# Altium schematic sheet 8-to-1_MUX.SchDoc: 8:1 MUX
size A3; Author: M.Beldyga; CompanyName: WUT ISE; DrawnBy: M.Beldyga; Organization: WUT ISE; Address1: PW ISE; Address2: Nowowiejska 15/19 00-665 Warsaw; Address3: micbeldyga@gmail.com; SheetNumber: 4; SheetTotal: 8; ModifiedBy: -; CheckedDate: -; DivGrp: WUT ISE; Designer: M.Beldyga; ModifiedDate: -; ProjectName: Sensor Box
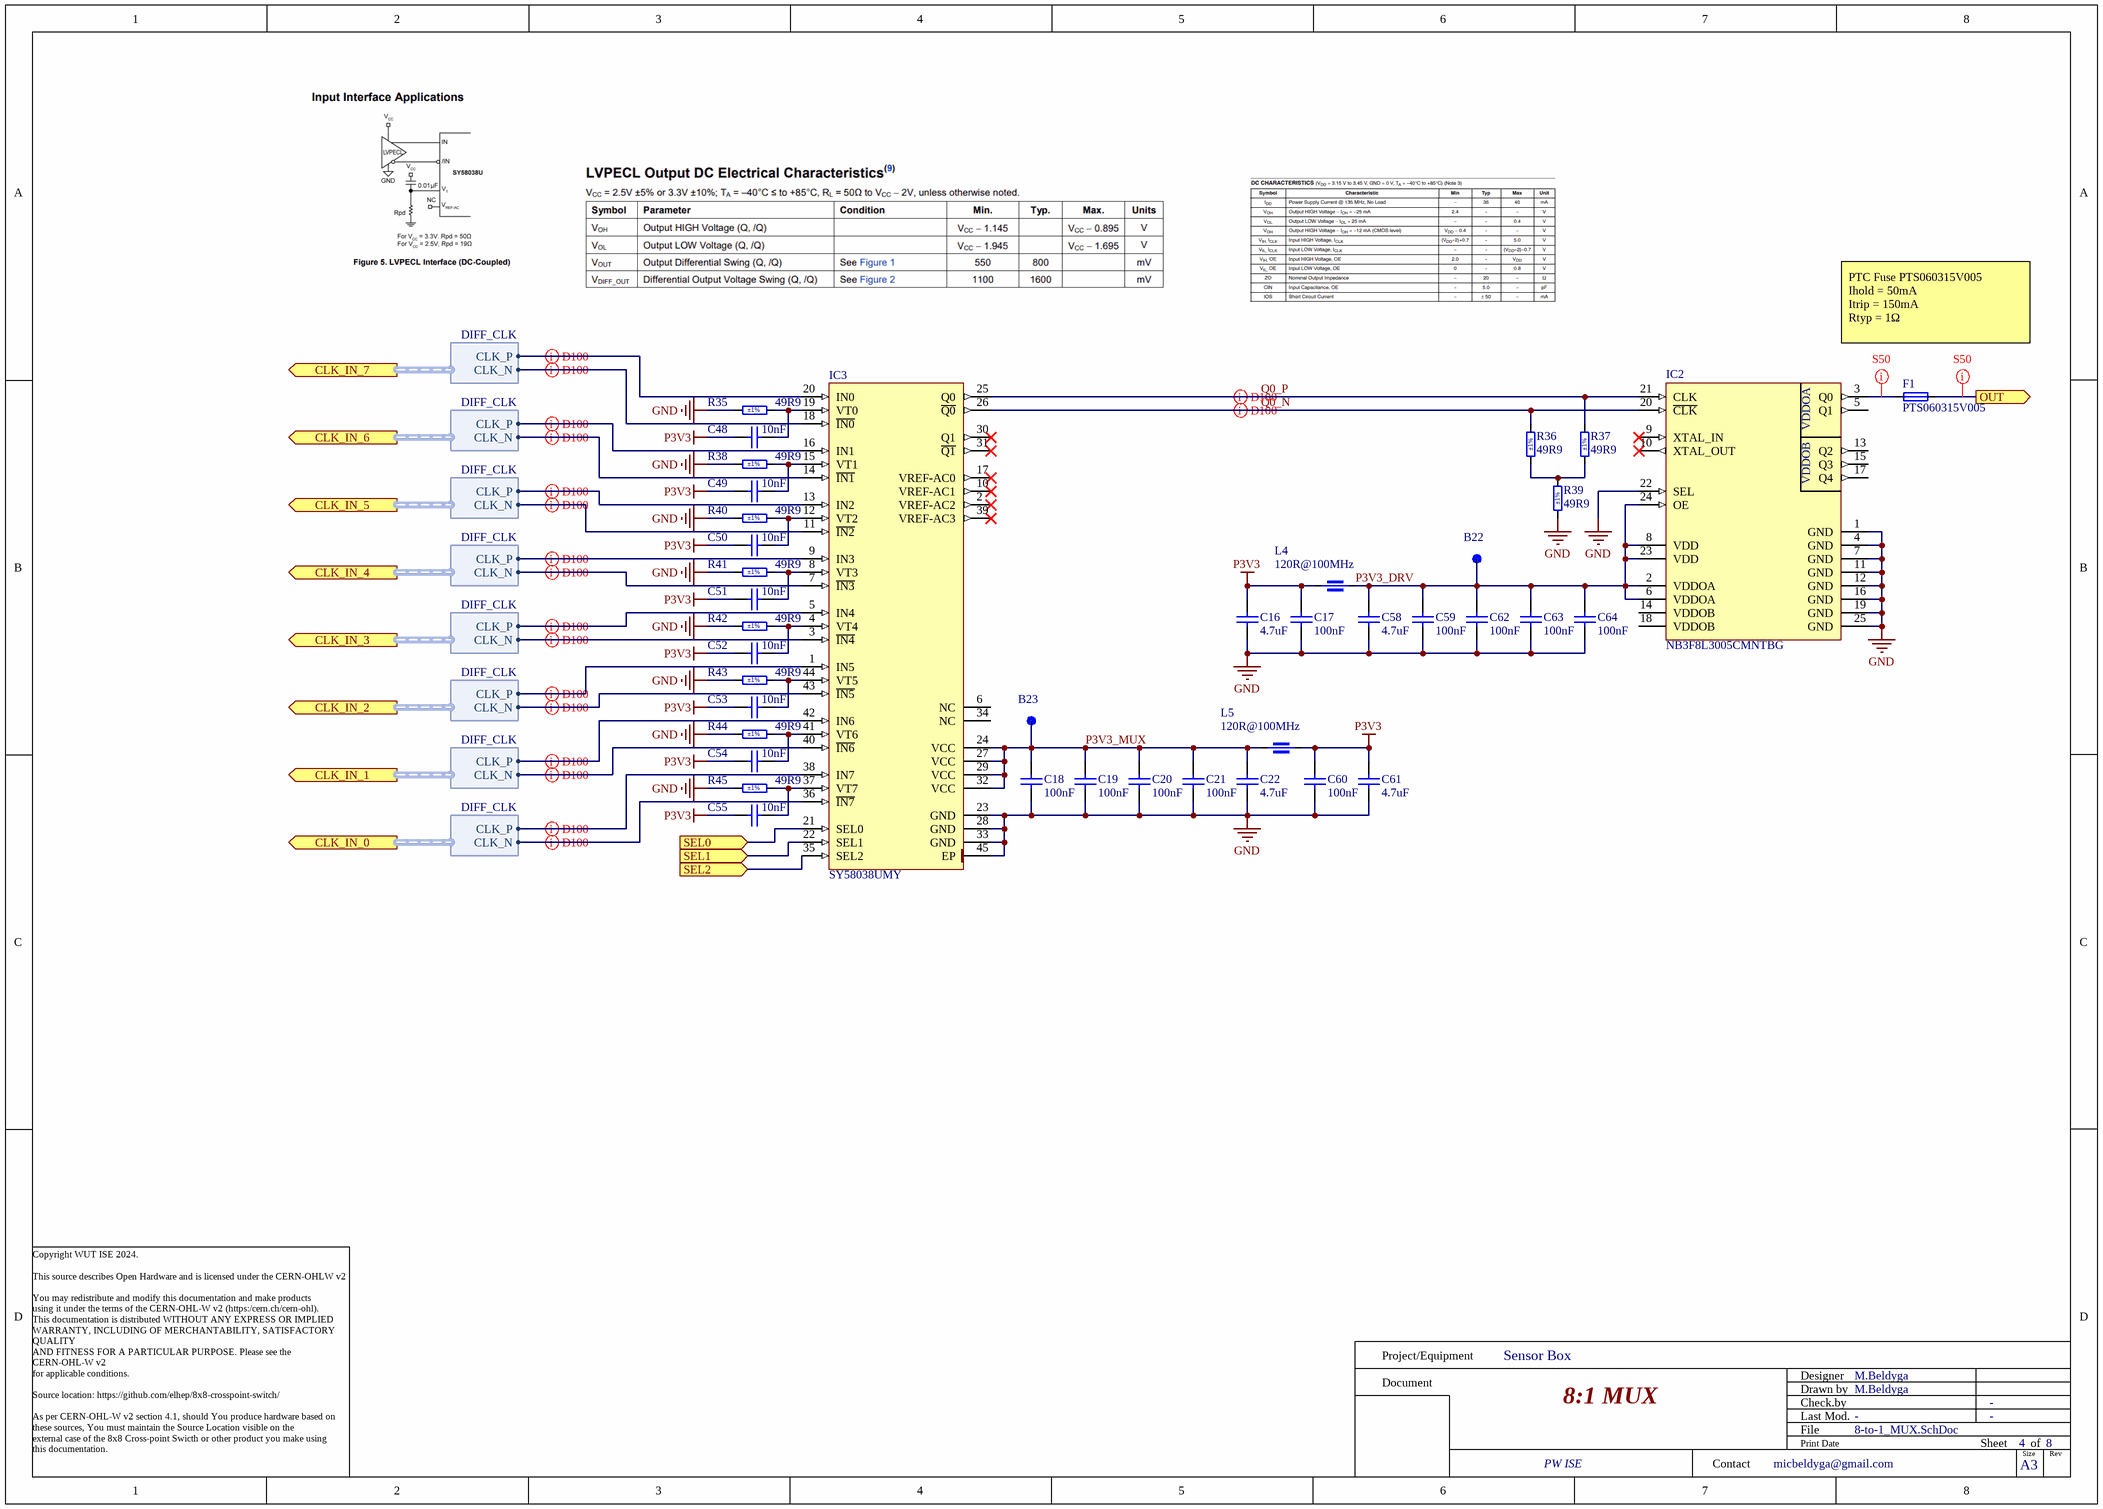
[diagram p0: 8-to-1_MUX.SchDoc]

## Parts
B22  SMD Pad  [C100]  (value not drawn)  (no BOM)
B23  SMD Pad  [C100]  (value not drawn)  (no BOM)
C16  4.7uF  [CAPC1608X90N]
C17  100nF  [CAPC1005X55N]
C18  100nF  [CAPC1005X55N]
C19  100nF  [CAPC1005X55N]
C20  100nF  [CAPC1005X55N]
C21  100nF  [CAPC1005X55N]
C22  4.7uF  [CAPC1608X90N]
C48  10nF  [CAPC1005X55N]
C49  10nF  [CAPC1005X55N]
C50  10nF  [CAPC1005X55N]
C51  10nF  [CAPC1005X55N]
C52  10nF  [CAPC1005X55N]
C53  10nF  [CAPC1005X55N]
C54  10nF  [CAPC1005X55N]
C55  10nF  [CAPC1005X55N]
C58  4.7uF  [CAPC1608X90N]
C59  100nF  [CAPC1005X55N]
C60  100nF  [CAPC1005X55N]
C61  4.7uF  [CAPC1608X90N]
C62  100nF  [CAPC1005X55N]
C63  100nF  [CAPC1005X55N]
C64  100nF  [CAPC1005X55N]
F1  PTS060315V005  [CAPC1709X08N]
IC2  NB3F8L3005CMNTBG  [QFN50P400X400X90_HS-25N]
IC3  SY58038UMY  [QFN50P700X700X100-45N-S340]
L4  120R@100MHz  [INDC1608X65N]
L5  120R@100MHz  [INDC1608X65N]
R35  49R9  Tolerance: ±1%  [RESC1005X40N]
R36  49R9  Tolerance: ±1%  [RESC1005X40N]
R37  49R9  Tolerance: ±1%  [RESC1005X40N]
R38  49R9  Tolerance: ±1%  [RESC1005X40N]
R39  49R9  Tolerance: ±1%  [RESC1005X40N]
R40  49R9  Tolerance: ±1%  [RESC1005X40N]
R41  49R9  Tolerance: ±1%  [RESC1005X40N]
R42  49R9  Tolerance: ±1%  [RESC1005X40N]
R43  49R9  Tolerance: ±1%  [RESC1005X40N]
R44  49R9  Tolerance: ±1%  [RESC1005X40N]
R45  49R9  Tolerance: ±1%  [RESC1005X40N]

## Ports
CLK_IN_0 (out, harness DIFF_CLK), CLK_IN_1 (out, harness DIFF_CLK), CLK_IN_2 (out, harness DIFF_CLK), CLK_IN_3 (out, harness DIFF_CLK), CLK_IN_4 (out, harness DIFF_CLK), CLK_IN_5 (out, harness DIFF_CLK), CLK_IN_6 (out, harness DIFF_CLK), CLK_IN_7 (out, harness DIFF_CLK), OUT (out), SEL0 (in), SEL1 (in), SEL2 (in)

## Harnesses
DIFF_CLK: CLK_P, CLK_N

## Nets
GND: C16.1 C17.1 C18.1 C19.1 C20.1 C21.1 C22.1 C58.1 C59.1 C60.1 C61.1 C62.1 C63.1 C64.1 IC2.1(GND) IC2.4(GND) IC2.7(GND) IC2.11(GND) IC2.12(GND) IC2.16(GND) IC2.19(GND) IC2.22(SEL) IC2.25(GND) IC3.23(GND) IC3.28(GND) IC3.33(GND) IC3.45(EP) R35.1 R38.1 R39.1 R40.1 R41.1 R42.1 R43.1 R44.1 R45.1
P3V3: C16.2 C17.2 C48.2 C49.2 C50.2 C51.2 C52.2 C53.2 C54.2 C55.2 C60.2 C61.2 L4.1 L5.2
OUT: F1.2 ; port OUT
P3V3_DRV: B22.1 C58.2 C59.2 C62.2 C63.2 C64.2 IC2.2(VDDOA) IC2.6(VDDOA) IC2.8(VDD) IC2.23(VDD) IC2.24(OE) L4.2
P3V3_MUX: B23.1 C18.2 C19.2 C20.2 C21.2 C22.2 IC3.24(VCC) IC3.27(VCC) IC3.29(VCC) IC3.32(VCC) L5.1
Q0_N: IC2.20(~{CLK}) IC3.26(~{Q0}) R36.2
Q0_P: IC2.21(CLK) IC3.25(Q0) R37.2
SEL0: IC3.21(SEL0) ; port SEL0
SEL1: IC3.22(SEL1) ; port SEL1
SEL2: IC3.35(SEL2) ; port SEL2
NetC48_1: C48.1 IC3.19(VT0) R35.2
NetC49_1: C49.1 IC3.15(VT1) R38.2
NetC50_1: C50.1 IC3.12(VT2) R40.2
NetC51_1: C51.1 IC3.8(VT3) R41.2
NetC52_1: C52.1 IC3.4(VT4) R42.2
NetC53_1: C53.1 IC3.44(VT5) R43.2
NetC54_1: C54.1 IC3.41(VT6) R44.2
NetC55_1: C55.1 IC3.37(VT7) R45.2
NetF1_1: F1.1 IC2.3(Q0)
NetIC3_1: IC3.1(IN5) ; port CLK_IN_2.CLK_P
NetIC3_3: IC3.3(~{IN4}) ; port CLK_IN_3.CLK_N
NetIC3_5: IC3.5(IN4) ; port CLK_IN_3.CLK_P
NetIC3_7: IC3.7(~{IN3}) ; port CLK_IN_4.CLK_N
NetIC3_9: IC3.9(IN3) ; port CLK_IN_4.CLK_P
NetIC3_11: IC3.11(~{IN2}) ; port CLK_IN_5.CLK_N
NetIC3_13: IC3.13(IN2) ; port CLK_IN_5.CLK_P
NetIC3_14: IC3.14(~{IN1}) ; port CLK_IN_6.CLK_N
NetIC3_16: IC3.16(IN1) ; port CLK_IN_6.CLK_P
NetIC3_18: IC3.18(~{IN0}) ; port CLK_IN_7.CLK_N
NetIC3_20: IC3.20(IN0) ; port CLK_IN_7.CLK_P
NetIC3_36: IC3.36(~{IN7}) ; port CLK_IN_0.CLK_N
NetIC3_38: IC3.38(IN7) ; port CLK_IN_0.CLK_P
NetIC3_40: IC3.40(~{IN6}) ; port CLK_IN_1.CLK_N
NetIC3_42: IC3.42(IN6) ; port CLK_IN_1.CLK_P
NetIC3_43: IC3.43(~{IN5}) ; port CLK_IN_2.CLK_N
NetR36_1: R36.1 R37.1 R39.2

Not connected (* = marked no-connect by the designer): IC2 5(Q1) 9(XTAL_IN)* 10(XTAL_OUT)* 13(Q2) 14(VDDOB) 15(Q3) 17(Q4) 18(VDDOB); IC3 2(VREF-AC2)* 6(NC) 10(VREF-AC1)* 17(VREF-AC0)* 30(Q1)* 31(~{Q1})* 34(NC) 39(VREF-AC3)*

## Layout directives
differential pair; net class D100: NetIC3_1, NetIC3_3, NetIC3_5, NetIC3_7, NetIC3_9, NetIC3_11, NetIC3_13, NetIC3_14, NetIC3_16, NetIC3_18, NetIC3_20, NetIC3_36, NetIC3_38, NetIC3_40, NetIC3_42, NetIC3_43, Q0_N, Q0_P
net class S50: NetF1_1, OUT

## Notes on the sheet
- PTC Fuse PTS060315V005
  Ihold = 50mA
  Itrip = 150mA
  Rtyp = 1Ω
- Copyright WUT ISE 2024.
  This source describes Open Hardware and is licensed under the CERN-OHLW v2
  You may redistribute and modify this documentation and make products
  using it under the terms of the CERN-OHL-W v2 (https:/cern.ch/cern-ohl).
  This documentation is distributed WITHOUT ANY EXPRESS OR IMPLIED
  WARRANTY, INCLUDING OF MERCHANTABILITY, SATISFACTORY QUALITY
  AND FITNESS FOR A PARTICULAR PURPOSE. Please see the CERN-OHL-W v2
  for applicable conditions.
  Source location: https://github.com/elhep/8x8-crosspoint-switch/
  As per CERN-OHL-W v2 section 4.1, should You produce hardware based on
  these sources, You must maintain the Source Location visible on the
  external case of the 8x8 Cross-point Swicth or other product you make using
  this documentation.
- Project/Equipment
- Document
- Designer
- Drawn by
- Check.by
- Contact
- File
- Last Mod.
- Print Date
- Sheet
- Size
- A3
- of
- Rev

## Library data of the parts
B22 B23 = SMD_PAD_D1MM: Pad; Part Description: 1mm Diameter SMD Pad; Mounted: No; Part Number: SMD_PAD_D1MM; Component Type: Standard (No BOM); Pin Count: 1; Family: SMD Pad; Socket: No; SMD: Yes; Sense: No; Status: None; ComponentHeight: 0mm; HelpURL: Undefined; Author: CERN DEM JLC; CreateDate: 10/10/2017; LatestRevisionDate: 10/10/2017; PackageDescription: 1mm Diameter SMD Pad
C16 C22 C58 C61 = CC0603_4.7UF_25V_10%_X5R: Non-polarised capacitor; Part Description: SMD Multilayer Chip Ceramic Capacitor; Manufacturer: GENERIC; Manufacturer1 Part Number: GRM188R61E475KE11D; Voltage: 25V; TC: X5R; Tolerance: ±10%; Part Number: CC0603_4.7UF_25V_10%_X5R; Component Kind: Standard; Component Type: Standard; Pin Count: 2; Value: 4.7uF; Status: None; Manufacturer Part Number: CC0603_4.7UF_25V_10%_X5R; Case: 0603; Mounted: Yes; Socket: No; SMD: Yes; Sense: No; Manufacturer1 Example: MURATA; Manufacturer1 ComponentHeight: 0.95mm; HelpURL: \\cern.ch\dfs\Applications\Altium\Datasheets\CC0603_MURATA_GRM188R61E475KE11D.pdf; Author: CERN DEM JLC; CreateDate: 11/10/2014; LatestRevisionDate: 11/10/2014
C17-C21 C59 C60 C62-C64 = CC0402_100NF_50V_10%_X7R: Non-polarised capacitor; Part Description: SMD Multilayer Chip Ceramic Capacitor; Manufacturer: GENERIC; Manufacturer1 Part Number: GRM155R71H104KE14D; Voltage: 50V; TC: X7R; Tolerance: ±10%; Part Number: CC0402_100NF_50V_10%_X7R; Component Kind: Standard; Component Type: Standard; Pin Count: 2; Value: 100nF; Status: None; Manufacturer Part Number: CC0402_100NF_50V_10%_X7R; Case: 0402; Mounted: Yes; Socket: No; SMD: Yes; Sense: No; Manufacturer1 Example: MURATA; Manufacturer1 ComponentHeight: 0.55mm; HelpURL: \\cern.ch\dfs\Applications\Altium\Datasheets\CC0402_MURATA_GRM155R71H104KE14D.pdf; Author: CERN DEM MR; CreateDate: 6/30/2017; LatestRevisionDate: 6/30/2017
C48-C55 = CC0402_10NF_50V_10%_X7R: Non-polarised capacitor; Part Description: SMD Multilayer Chip Ceramic Capacitor; Manufacturer: GENERIC; Manufacturer1 Part Number: GRM155R71H103KA88D; Voltage: 50V; TC: X7R; Tolerance: ±10%; Part Number: CC0402_10NF_50V_10%_X7R; Component Kind: Standard; Component Type: Standard; Pin Count: 2; Value: 10nF; Status: None; Manufacturer Part Number: CC0402_10NF_50V_10%_X7R; Case: 0402; Mounted: Yes; Socket: No; SMD: Yes; Sense: No; Manufacturer1 Example: MURATA; Manufacturer1 ComponentHeight: 0.55mm; HelpURL: \\cern.ch\dfs\Applications\Altium\Datasheets\CC0402_X7R_MURATA_GRM.pdf; Author: CERN DEM MR; CreateDate: 1/8/2016; LatestRevisionDate: 1/8/2016
F1 = PTS060315V005: Ptc Reset Fuse 50MA 15V 0603; Manufacturer: Eaton Bussmann; Supplier: Mouser; Supplier Part Number: 504-PTS060315V005; Manufacturer Part Number: PTS060315V005; RoHS: No; Category: PTC Resettable Fuses; Stock: 5464; Pricing: 1=0.19, 10=0.16, 50=0.16, 100=0.132, 1000=0.105, 10000=0.065 (USD); ComponentLink1URL: https://datasheet.octopart.com/PTS060315V005-Cooper-Bussmann-datasheet-158256509.pdf?src-supplier=Sager+Electronics; ComponentLink1Description: https://datasheet.octopart.com/PTS060315V005-Cooper-Bussmann-datasheet-158256509.pdf?src-supplier=Sager+Electronics
IC2 = NB3F8L3005CMNTBG: 2: 1: 5 LVCMOS Fanout Buffer, 3.3V / 2.5V / 1.8V / 1.5V; Manufacturer: ON Semiconductor; Supplier: Mouser; Supplier Part Number: 863-NB3F8L3005CMNTBG; Manufacturer Part Number: NB3F8L3005CMNTBG; RoHS: Yes; Category: Clock Buffers, Drivers; Stock: 1836; Pricing: 1=5.88, 10=5.28, 50=4.99, 100=3.72, 1000=3.22, 10000=2.74 (USD); ComponentLink1URL: https://datasheet.ciiva.com/29660/nb3f8l3005c-d-29660305.pdf?src-supplier=Avnet; ComponentLink1Description: https://datasheet.ciiva.com/29660/nb3f8l3005c-d-29660305.pdf?src-supplier=Avnet; ComponentLink2URL: https://datasheet.ciiva.com/30038/nb3f8l3005c-d-30038412.pdf?src-supplier=Avnet; ComponentLink2Description: https://datasheet.ciiva.com/30038/nb3f8l3005c-d-30038412.pdf?src-supplier=Avnet; ComponentLink3URL: https://datasheet.ciiva.com/29660/nb3f8l3005c-d-29660458.pdf?src-supplier=Digikey; ComponentLink3Description: https://datasheet.ciiva.com/29660/nb3f8l3005c-d-29660458.pdf?src-supplier=Digikey; ComponentLink4URL: https://datasheet.ciiva.com/29660/nb3f8l3005c-d-29660459.pdf?src-supplier=Digikey; ComponentLink4Description: https://datasheet.ciiva.com/29660/nb3f8l3005c-d-29660459.pdf?src-supplier=Digikey; ComponentLink5URL: https://datasheet.ciiva.com/29660/nb3f8l3005c-d-29660460.pdf?src-supplier=Digikey; ComponentLink5Description: https://datasheet.ciiva.com/29660/nb3f8l3005c-d-29660460.pdf?src-supplier=Digikey
IC3 = SY58038UMY: Precision Low-Power 8:1 MUX with Internal Termination and 1:2 LVPECL Fanout Buffer; Part Description: Ultra-Precision, 8:1 MUX with Internal Termination and 1:2 LVPECL Fanout Buffer; Manufacturer: MICREL; PressFit: No; Bonding: No; Part Number: SY58038UMY; Component Kind: Standard; Component Type: Standard; Device: SY58038UMY; PackageDescription: QFN, 0.50mm Pitch, Square; 44 Pin, 7.00mm L X 7.00mm W X 1.00mm H body (w/Thermal Tab 3.40 X 3.40mm), IPC Medium Density; Manufacturer Part Number: SY58038UMY; Pin Count: 45; Case: QFN44; Mounted: Yes; Socket: No; SMD: Yes; Sense: No; ComponentHeight: 1mm; Author: CERN DEM HF; HelpURL: \\cern.ch\dfs\Applications\Altium\Datasheets\SY58038U.pdf; CreateDate: 4/17/2023; LatestRevisionDate: 4/17/2023
L4 L5 = IND0603_MURATA_BLM18SG121TN1D: Part Description: SMD EMIFIL Suppression Chip Ferrite Bead; Manufacturer: MURATA; Power: 3A; Resistance: 0.025R; Tolerance: ±25%; Part Number: IND0603_MURATA_BLM18SG121TN1D; Component Kind: Standard; Component Type: Standard; Pin Count: 2; Value: 120R@100MHz; Manufacturer Part Number: BLM18SG121TN1D; Case: 0603; Mounted: Yes; Socket: No; SMD: Yes; Sense: No; ComponentHeight: 0.65mm; HelpURL: \\cern.ch\dfs\Applications\Altium\Datasheets\IND0603_MURATA_BLM18S.pdf; Author: CERN DEM JLC; CreateDate: 7/23/2014; LatestRevisionDate: 10/25/2018
R35-R45 = R0402_49R9_1%_0.0625W_100PPM: Resistor - 1%; Part Description: General Purpose Thick Film Chip Resistor; Manufacturer: GENERIC; Manufacturer1 Part Number: 232270674999L or RC0402FR-0749R9L; TC: ±100ppm/°C; PressFit: No; Part Number: R0402_49R9_1%_0.0625W_100PPM; Component Kind: Standard; Component Type: Standard; Pin Count: 2; Value: 49R9; Status: Not Recommended; Power: 0.0625W; Manufacturer Part Number: R0402_49R9_1%_0.0625W_100PPM; Case: 0402; Mounted: Yes; Sense: No; Socket: No; SMD: Yes; Manufacturer1 Example: YAGEO PHYCOMP; Manufacturer1 ComponentHeight: 0.4mm; HelpURL: \\cern.ch\dfs\Applications\Altium\Datasheets\R0402_Phycomp_RC0402.pdf; Author: CERN DEM JLC; CreateDate: 10/24/2012; LatestRevisionDate: 10/24/2012